# EasyEDA schematic SCH_SmartPark_2023-12-14.json
TITLE: Sheet_1; REV: 1.0; Date: 2023-10-21; Sheet: 1/1; Drawn By: vito; Company: Your Company
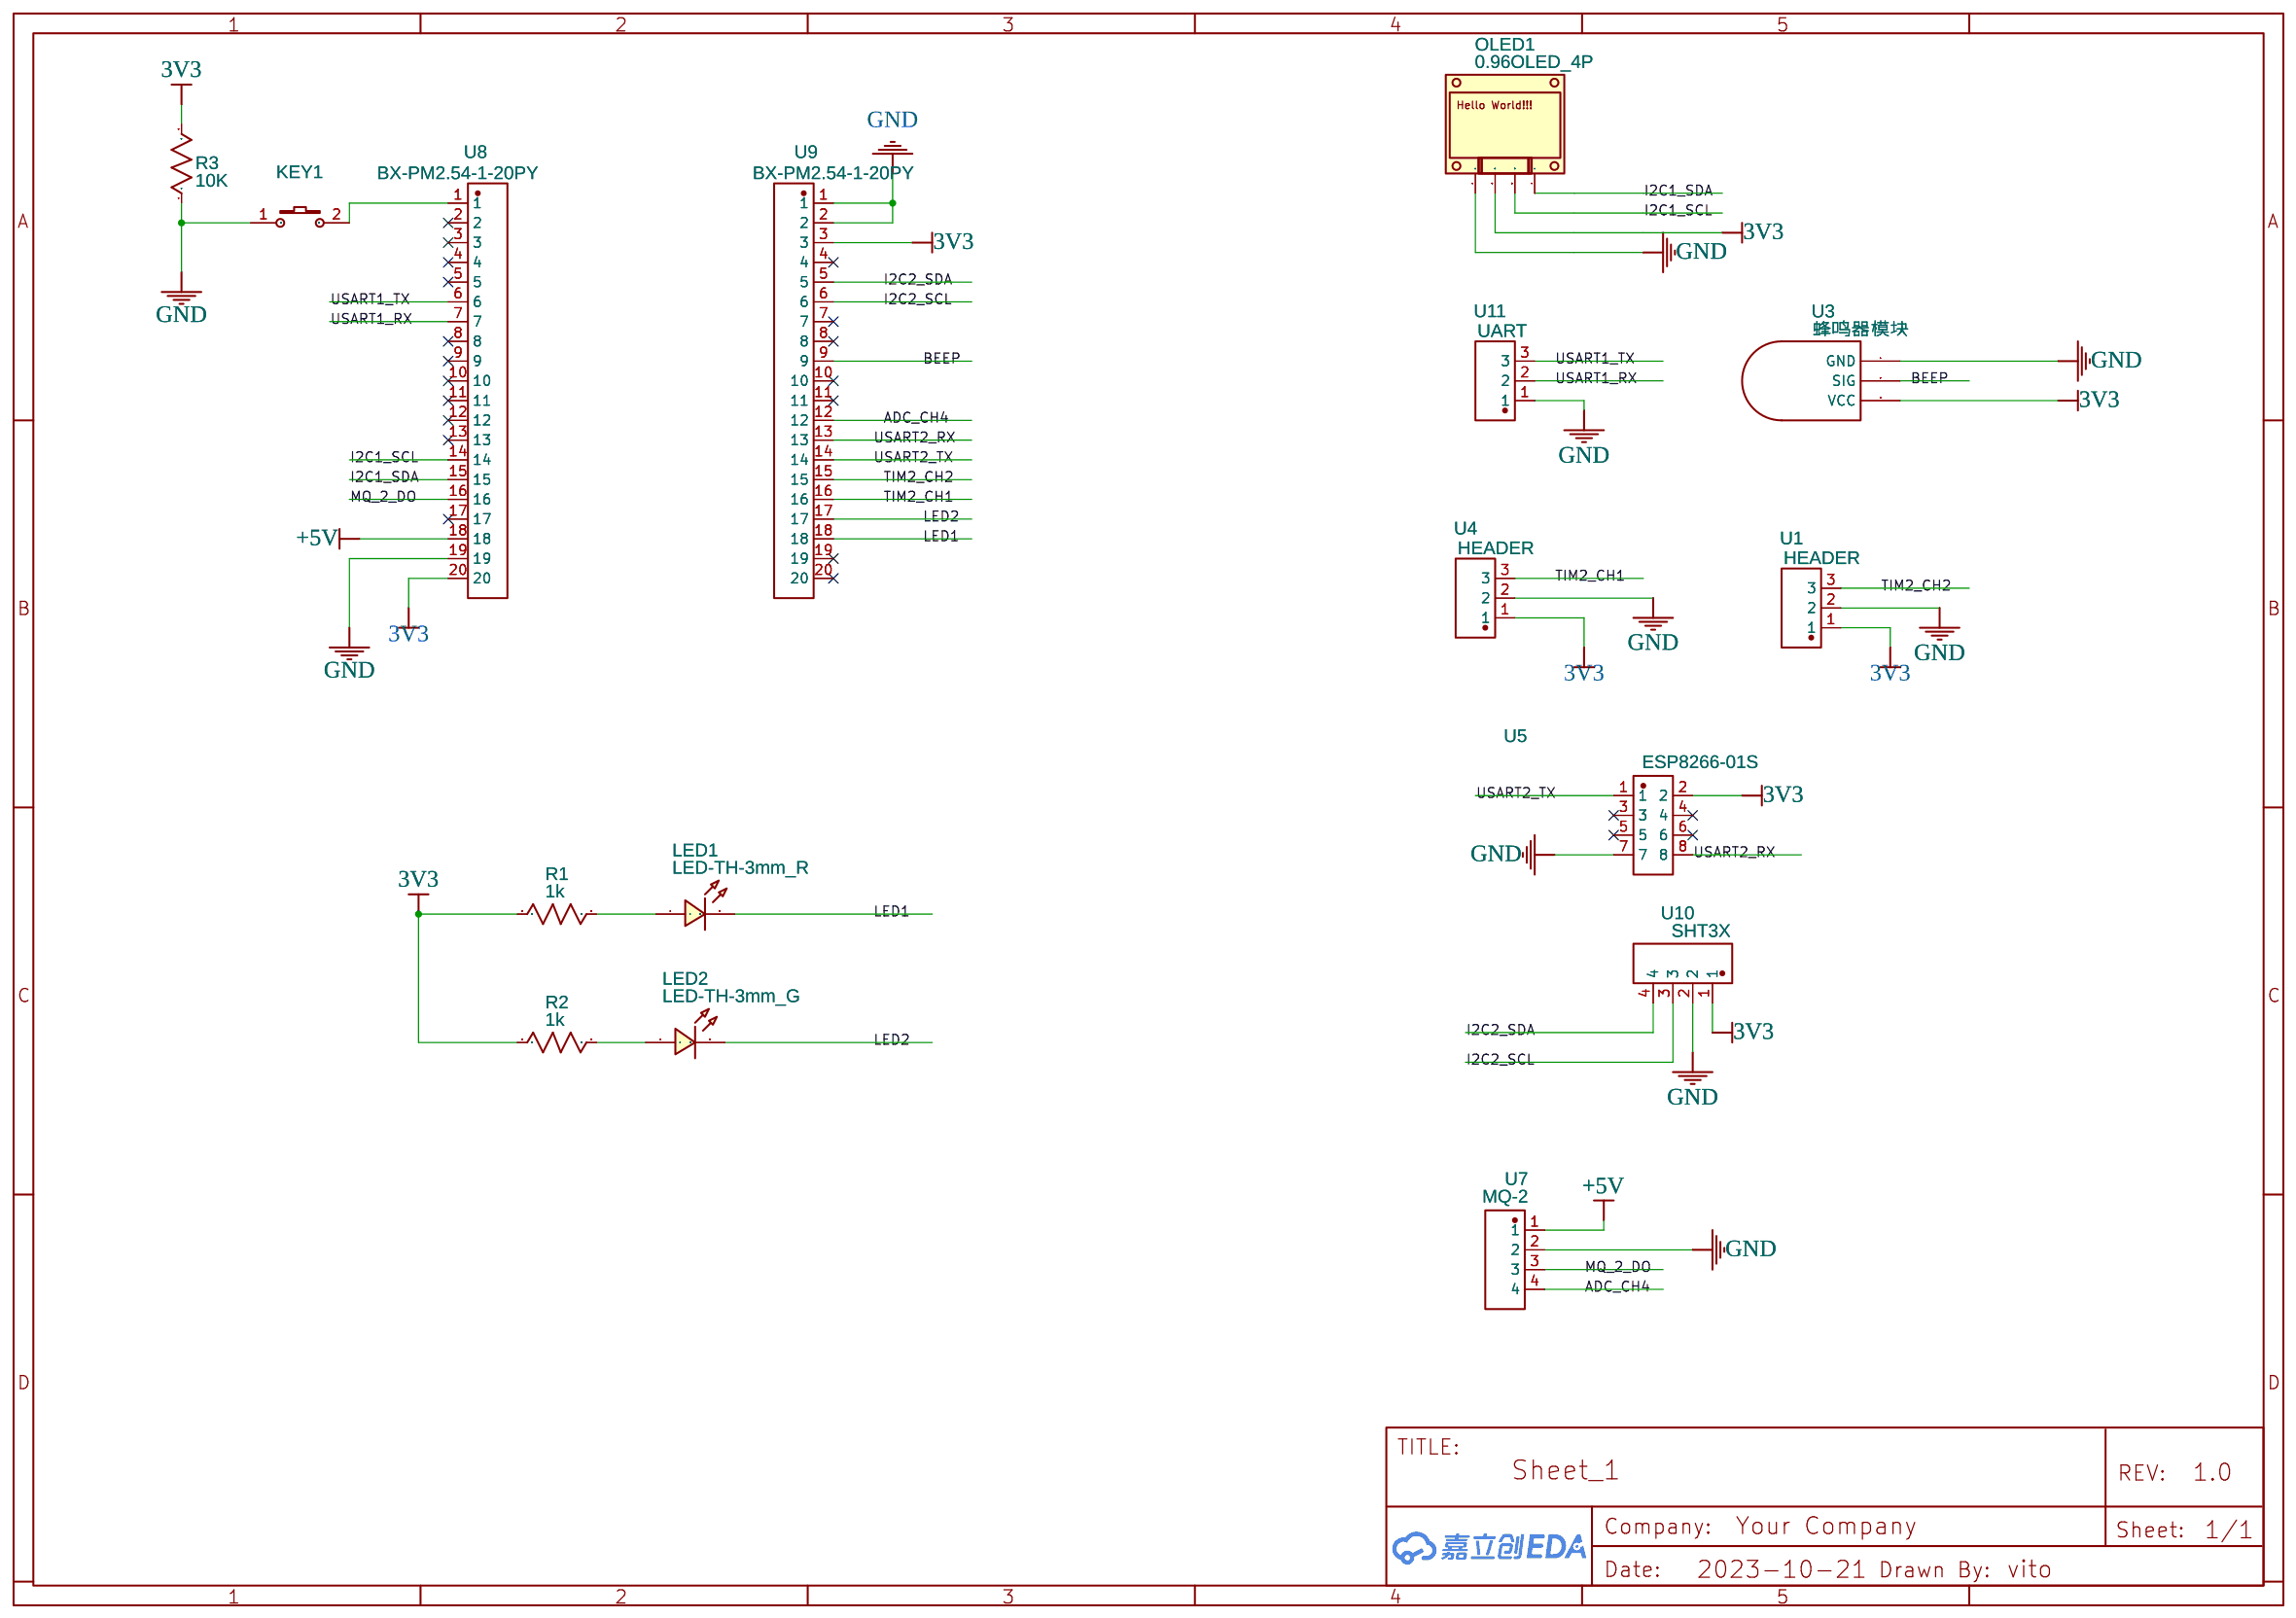
[diagram p0: schematic sheet]

## Parts
KEY1  K2-3.6×6.1_SMD  [KEY-SMD_2P-L6.2-W3.6-LS8.0]
LED1  LED-TH-3mm_R  [LED-TH_BD3.0_RED]
LED2  LED-TH-3mm_G  [LED-TH_BD3.0_GREEN]
OLED1  0.96OLED_4P  [0.96OLED_4P]
R1  1k  [R_AXIAL-0.4]
R2  1k  [R_AXIAL-0.4]
R3  10K  [R_AXIAL-0.4]
U1  HEADER  [HDR-TH_3P-P2.54-V-F]
U3  蜂鸣器模块  [蜂鸣器模块]
U4  HEADER  [HDR-TH_3P-P2.54-V-F]
U5  ESP8266-01S  [HDR-TH_8P-P2.54-V-F-R2-C4-S2.54-1]
U7  MQ-2  [HDR-TH_4P-P2.54-V-M-1]
U8  BX-PM2.54-1-20PY  [HDR-TH_20P-P2.54-V-F]
U9  BX-PM2.54-1-20PY  [HDR-TH_20P-P2.54-V-F]
U10  SHT3X  [HDR-TH_4P-P2.54-V-M-1]
U11  UART  [HDR-TH_3P-P2.54-V-F]

## Library data of the parts
KEY1 = K2-3.6×6.1_SMD: Supplier Part: C118141; Supplier: LCSC; Manufacturer Part: K2-1107ST-A4SW-06; Contributor: LCEDA_Lib; 制造商: 韩国韩荣
LED1 = LED-TH-3mm_R: Manufacturer: EVERLIGHT(台湾亿光); Manufacturer Part: 204-10SDRD/S530-A3-L; Supplier Part: C84774; Supplier: LCSC; Contributor: LCEDA_Lib
LED2 = LED-TH-3mm_G: Manufacturer: EVERLIGHT(台湾亿光); Manufacturer Part: 204-10SYGD/S530-E3; Supplier Part: C85161; Contributor: LCEDA_Lib
OLED1 = 0.96OLED_4P: Supplier: LCSC; Contributor: LCEDA_Lib; Package Display: No
R1-R3 = R_AXIAL-0.4_US: Contributor: LCEDA_Lib
U1 U4 U11 = BX-PM2.54-1-3PY: Supplier: LCSC; Supplier Part: C18078126; Manufacturer: Bossie(博锡); Contributor: lcsc; link: https://so.szlcsc.com/global.html?k=C18078126&ref=editor
U3 = 蜂鸣器模块: Contributor: onesecplus
U5 = ESP8266-TH8: Contributor: LCSC; Supplier: LCSC; Supplier Part: C9900003199; Manufacturer: null; JLCPCB Part Class: Extended Part; link: https://so.szlcsc.com/global.html?k=C9900003199&ref=editor
U7 U10 = HEADER_1*4P: Contributor: LCSC; Supplier: LCSC; Supplier Part: C9900003200; Manufacturer: null; JLCPCB Part Class: Extended Part; link: https://so.szlcsc.com/global.html?k=C9900003200&ref=editor
U8 U9 = BX-PM2.54-1-20PY: Supplier: LCSC; Supplier Part: C18078139; Manufacturer: Bossie(博锡); Contributor: lcsc; link: https://so.szlcsc.com/global.html?k=C18078139&ref=editor

## Nets
3V3: OLED1.2 R1.1 R2.1 R3.2 U1.1 U3.3(VCC) U4.1 U5.2 U8.20 U9.3 U10.1
+5V: U7.1 U8.18
GND: KEY1.1 OLED1.1 R3.1 U1.2 U3.1(GND) U4.2 U5.7 U7.2 U8.19 U9.1 U9.2 U10.2 U11.1
ADC_CH4: U7.4 U9.12
BEEP: U3.2(SIG) U9.9
I2C1_SCL: OLED1.3 U8.14
I2C1_SDA: OLED1.4 U8.15
I2C2_SCL: U9.6 U10.3
I2C2_SDA: U9.5 U10.4
LED1: LED1.2 U9.18
LED2: LED2.2 U9.17
MQ_2_DO: U7.3 U8.16
TIM2_CH1: U4.3 U9.16
TIM2_CH2: U1.3 U9.15
USART1_RX: U8.7 U11.2
USART1_TX: U8.6 U11.3
USART2_RX: U5.8 U9.13
USART2_TX: U5.1 U9.14
Net-(KEY1-2): KEY1.2 U8.1
Net-(LED1-1): LED1.1 R1.2
Net-(LED2-1): LED2.1 R2.2

Not connected (* = marked no-connect by the designer): U5 3* 4* 5* 6*; U8 2* 3* 4* 5* 8* 9* 10* 11* 12* 13* 17*; U9 4* 7* 8* 10* 11* 19* 20*
